# Altium schematic sheet Current Sense.SchDoc
size C
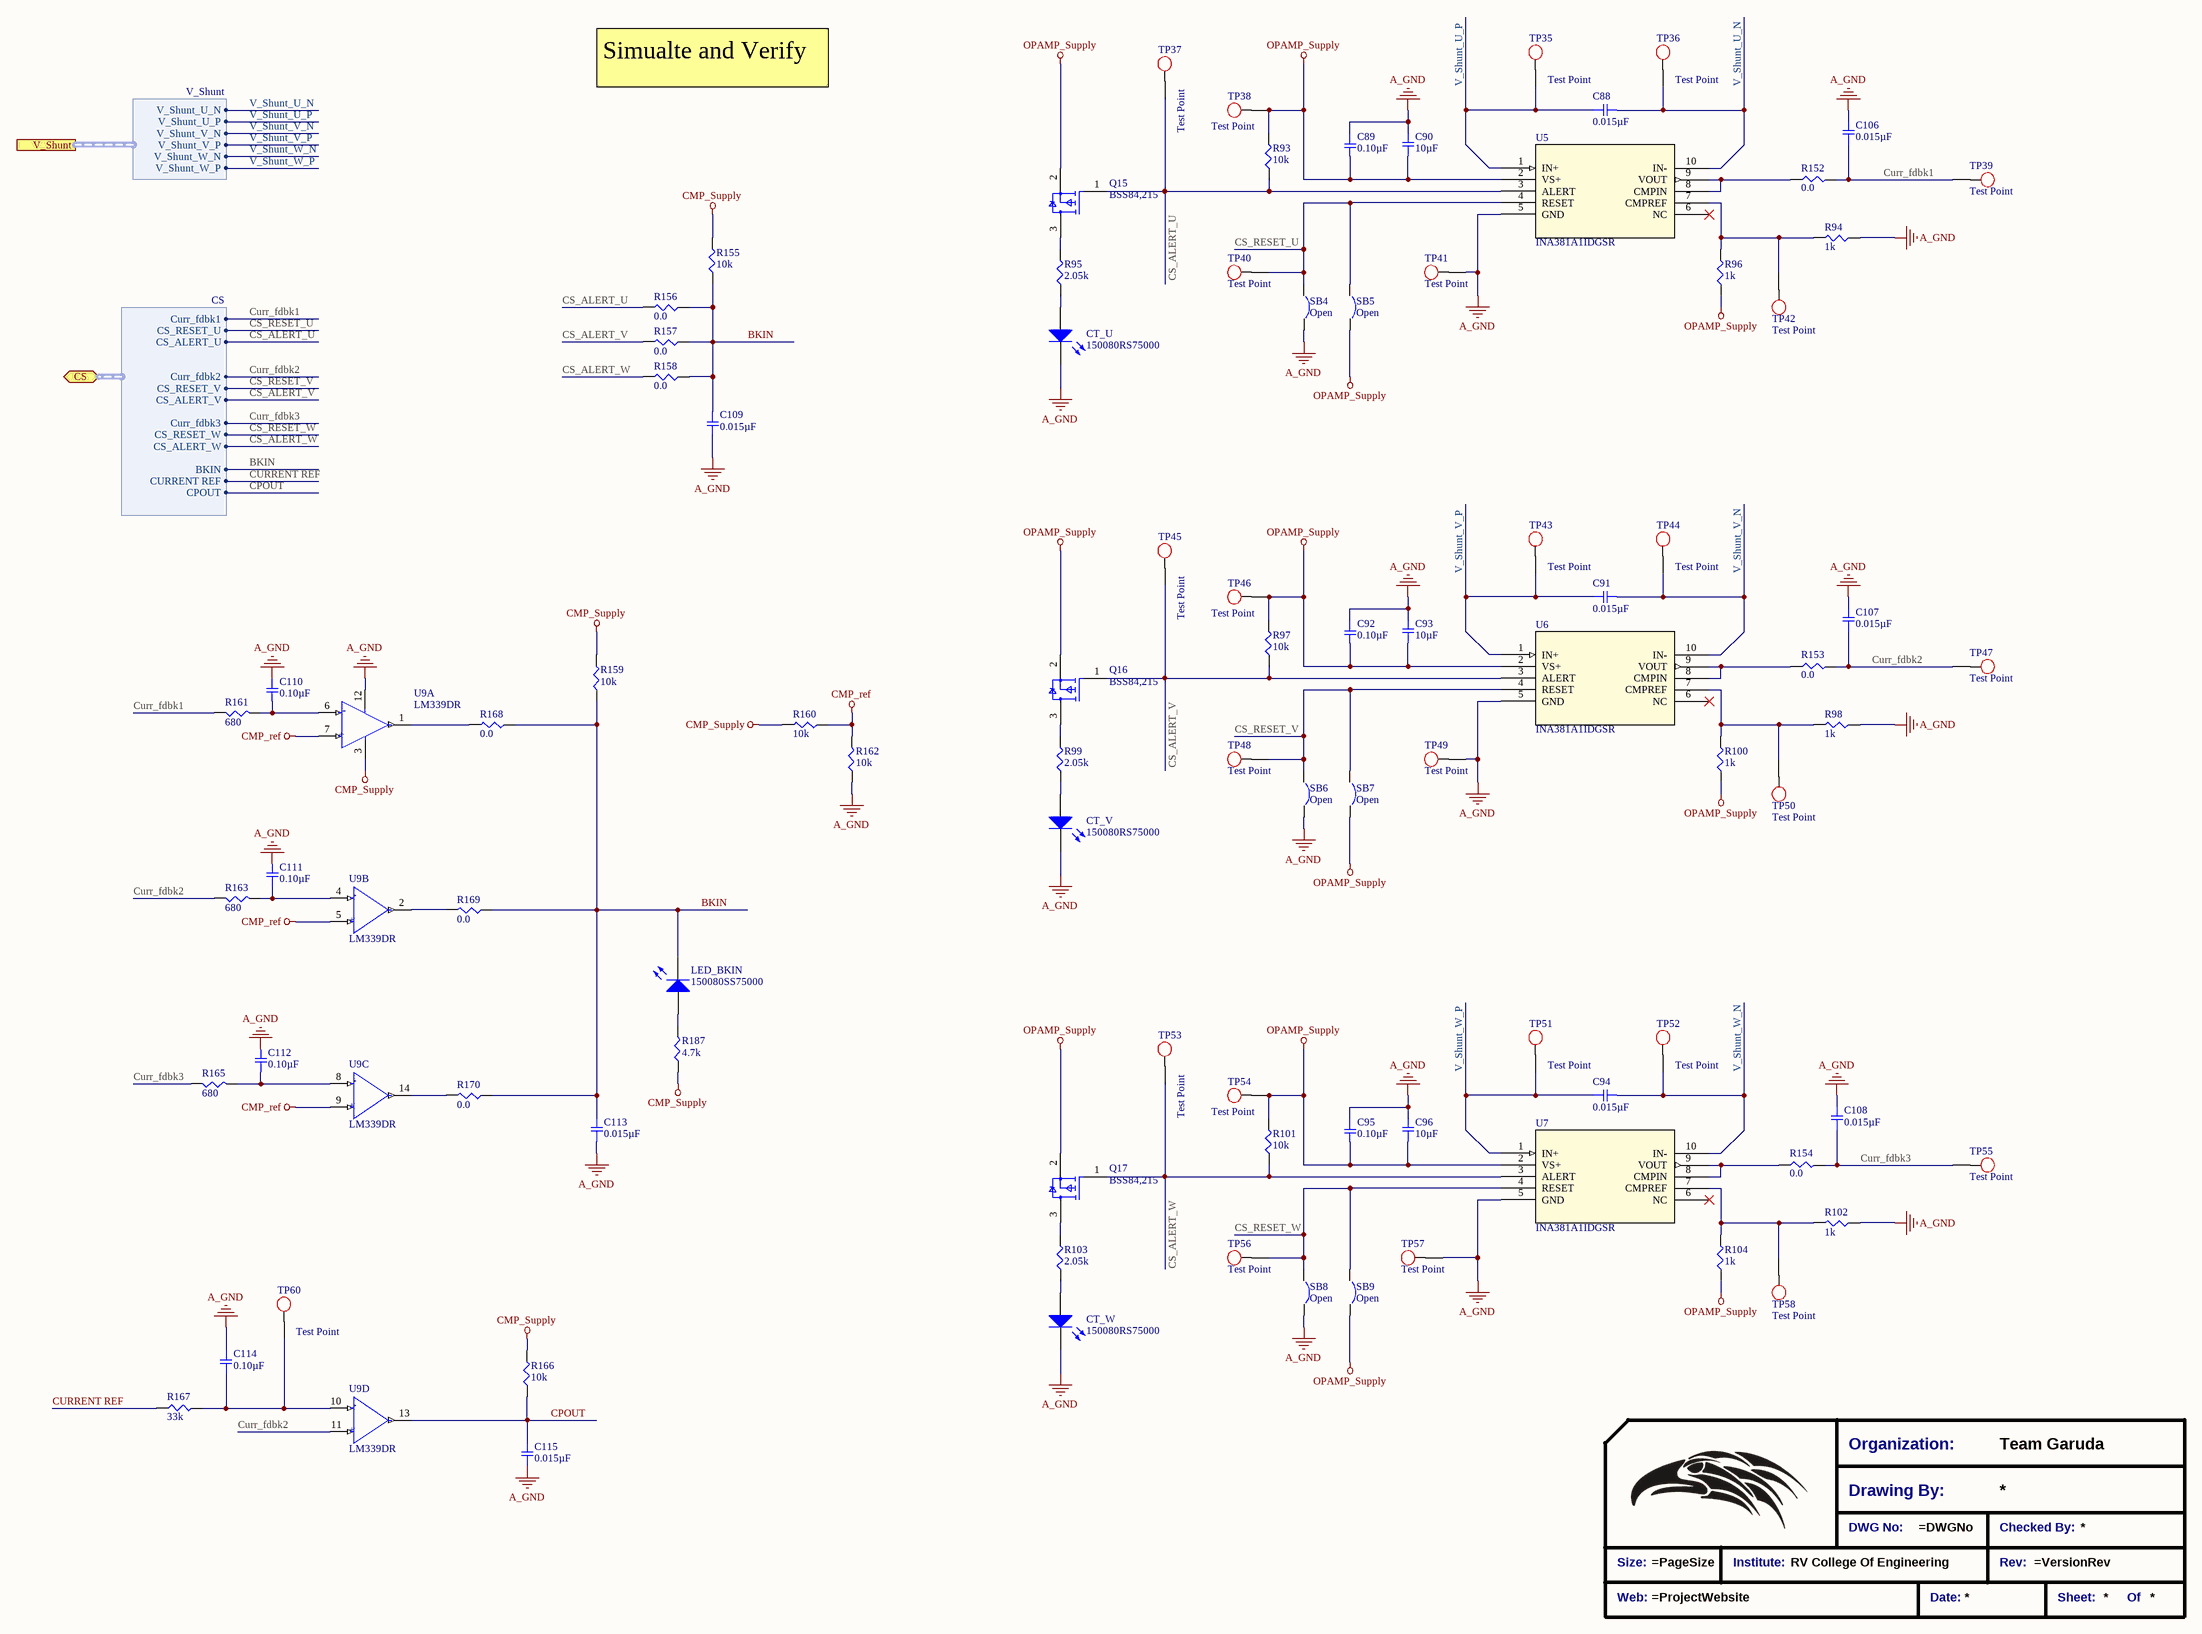
[diagram p0: Current Sense.SchDoc]

## Parts
*?  Title_Block  (value not drawn)  (graphical)
C88  0.015µF  [SMD-0603C]
C89  0.10µF  [SMD-0805C]
C90  10µF  [SMD-1206C]
C91  0.015µF  [SMD-0603C]
C92  0.10µF  [SMD-0805C]
C93  10µF  [SMD-1206C]
C94  0.015µF  [SMD-0603C]
C95  0.10µF  [SMD-0805C]
C96  10µF  [SMD-1206C]
C106  0.015µF  [SMD-0603C]
C107  0.015µF  [SMD-0603C]
C108  0.015µF  [SMD-0603C]
C109  0.015µF  [SMD-0603C]
C110  0.10µF  [SMD-0805C]
C111  0.10µF  [SMD-0805C]
C112  0.10µF  [SMD-0805C]
C113  0.015µF  [SMD-0603C]
C114  0.10µF  [SMD-0805C]
C115  0.015µF  [SMD-0603C]
CT_U  150080RS75000  [0805_A]
CT_V  150080RS75000  [0805_A]
CT_W  150080RS75000  [0805_A]
LED_BKIN  150080SS75000  [0805_A]
Q15  BSS84,215  [FP-SOT23-MFG]
Q16  BSS84,215  [FP-SOT23-MFG]
Q17  BSS84,215  [FP-SOT23-MFG]
R93  10k  [SMD-0603-RES]
R94  1k  [SMD-0603-RES]
R95  2.05k  [SMD-0603-RES]
R96  1k  [SMD-0603-RES]
R97  10k  [SMD-0603-RES]
R98  1k  [SMD-0603-RES]
R99  2.05k  [SMD-0603-RES]
R100  1k  [SMD-0603-RES]
R101  10k  [SMD-0603-RES]
R102  1k  [SMD-0603-RES]
R103  2.05k  [SMD-0603-RES]
R104  1k  [SMD-0603-RES]
R152  0.0  [SMD-0603-RES]
R153  0.0  [SMD-0603-RES]
R154  0.0  [SMD-0603-RES]
R155  10k  [SMD-0603-RES]
R156  0.0  [SMD-0603-RES]
R157  0.0  [SMD-0603-RES]
R158  0.0  [SMD-0603-RES]
R159  10k  [SMD-0603-RES]
R160  10k  [SMD-0603-RES]
R161  680  [SMD-0603-RES]
R162  10k  [SMD-0603-RES]
R163  680  [SMD-0603-RES]
R165  680  [SMD-0603-RES]
R166  10k  [SMD-0603-RES]
R167  33k  [SMD-0603-RES]
R168  0.0  [SMD-0603-RES]
R169  0.0  [SMD-0603-RES]
R170  0.0  [SMD-0603-RES]
R187  4.7k  [SMD-0805-RES]
SB4  Open  [SB_0603]  (no BOM)
SB5  Open  [SB_0603]  (no BOM)
SB6  Open  [SB_0603]  (no BOM)
SB7  Open  [SB_0603]  (no BOM)
SB8  Open  [SB_0603]  (no BOM)
SB9  Open  [SB_0603]  (no BOM)
TP35  Test Point  [Test_point_THT]  (no BOM)
TP36  Test Point  [Test_point_THT]  (no BOM)
TP37  Test Point  [Test_point_THT]  (no BOM)
TP38  Test Point  [Test_point_SMD]  (no BOM)
TP39  Test Point  [Test_point_THT]  (no BOM)
TP40  Test Point  [Test_point_SMD]  (no BOM)
TP41  Test Point  [Test_point_THT]  (no BOM)
TP42  Test Point  [Test_point_THT]  (no BOM)
TP43  Test Point  [Test_point_THT]  (no BOM)
TP44  Test Point  [Test_point_THT]  (no BOM)
TP45  Test Point  [Test_point_THT]  (no BOM)
TP46  Test Point  [Test_point_SMD]  (no BOM)
TP47  Test Point  [Test_point_THT]  (no BOM)
TP48  Test Point  [Test_point_SMD]  (no BOM)
TP49  Test Point  [Test_point_THT]  (no BOM)
TP50  Test Point  [Test_point_THT]  (no BOM)
TP51  Test Point  [Test_point_THT]  (no BOM)
TP52  Test Point  [Test_point_THT]  (no BOM)
TP53  Test Point  [Test_point_THT]  (no BOM)
TP54  Test Point  [Test_point_SMD]  (no BOM)
TP55  Test Point  [Test_point_THT]  (no BOM)
TP56  Test Point  [Test_point_SMD]  (no BOM)
TP57  Test Point  [Test_point_THT]  (no BOM)
TP58  Test Point  [Test_point_THT]  (no BOM)
TP60  Test Point  [Test_point_THT]  (no BOM)
U5  INA381A1IDGSR  [TSSOP50P490X110-10N]
U6  INA381A1IDGSR  [TSSOP50P490X110-10N]
U7  INA381A1IDGSR  [TSSOP50P490X110-10N]
U9  LM339DR  [FP-D0014A-MFG]  (parts A,B,C,D of 4)

## Ports
CS (bidir, harness CS), V_Shunt (harness V_Shunt)

## Harnesses
CS: Curr_fdbk1, CS_RESET_U, CS_ALERT_U, Curr_fdbk2, CS_RESET_V, CS_ALERT_V, Curr_fdbk3, CS_RESET_W, CS_ALERT_W, BKIN, CURRENT REF, CPOUT
V_Shunt: V_Shunt_U_N, V_Shunt_U_P, V_Shunt_V_N, V_Shunt_V_P, V_Shunt_W_N, V_Shunt_W_P

## Nets
A_GND: C89.1 C90.2 C92.1 C93.2 C95.1 C96.2 C106.2 C107.2 C108.2 C109.2 C110.1 C111.2 C112.2 C113.1 C114.2 C115.1 CT_U.1(K) CT_V.1(K) CT_W.1(K) R94.1 R98.1 R102.1 R162.1 SB4.1 SB6.1 SB8.1 TP41.1 TP49.1 TP57.1 U5.5(GND) U6.5(GND) U7.5(GND) U9.12(GND)
CMP_ref: R160.1 R162.2 U9.5(2IN+) U9.7(1IN+) U9.9(3IN+)
CMP_Supply: R155.2 R159.2 R160.2 R166.2 R187.1 U9.3(VCC)
OPAMP_Supply: C89.2 C90.1 C92.2 C93.1 C95.2 C96.1 Q15.2(S) Q16.2(S) Q17.2(S) R93.2 R96.1 R97.2 R100.1 R101.2 R104.1 SB5.1 SB7.1 SB9.1 TP38.1 TP46.1 TP54.1 U5.2(VS+) U6.2(VS+) U7.2(VS+)
BKIN: C109.1 C113.2 LED_BKIN.1(K) R155.1 R156.1 R157.1 R158.1 R159.1 R168.1 R169.1 R170.1 ; port CS.BKIN
CPOUT: C115.2 R166.1 U9.13(OUT4) ; port CS.CPOUT
CS_ALERT_U: Q15.1(G) R93.1 R156.2 TP37.1 U5.3(ALERT) ; port CS.CS_ALERT_U
CS_ALERT_V: Q16.1(G) R97.1 R157.2 TP45.1 U6.3(ALERT) ; port CS.CS_ALERT_V
CS_ALERT_W: Q17.1(G) R101.1 R158.2 TP53.1 U7.3(ALERT) ; port CS.CS_ALERT_W
CS_RESET_U: SB4.2 SB5.2 TP40.1 U5.4(RESET) ; port CS.CS_RESET_U
CS_RESET_V: SB6.2 SB7.2 TP48.1 U6.4(RESET) ; port CS.CS_RESET_V
CS_RESET_W: SB8.2 SB9.2 TP56.1 U7.4(RESET) ; port CS.CS_RESET_W
Curr_fdbk1: C106.1 R152.2 R161.1 TP39.1 ; port CS.Curr_fdbk1
Curr_fdbk2: C107.1 R153.2 R163.1 TP47.1 U9.11(4IN+) ; port CS.Curr_fdbk2
Curr_fdbk3: C108.1 R154.2 R165.1 TP55.1 ; port CS.Curr_fdbk3
CURRENT REF: R167.1 ; port CS.CURRENT REF
V_Shunt_U_N: C88.2 TP36.1 U5.10(IN-) ; port V_Shunt.V_Shunt_U_N
V_Shunt_U_P: C88.1 TP35.1 U5.1(IN+) ; port V_Shunt.V_Shunt_U_P
V_Shunt_V_N: C91.2 TP44.1 U6.10(IN-) ; port V_Shunt.V_Shunt_V_N
V_Shunt_V_P: C91.1 TP43.1 U6.1(IN+) ; port V_Shunt.V_Shunt_V_P
V_Shunt_W_N: C94.2 TP52.1 U7.10(IN-) ; port V_Shunt.V_Shunt_W_N
V_Shunt_W_P: C94.1 TP51.1 U7.1(IN+) ; port V_Shunt.V_Shunt_W_P
NetC110_2: C110.2 R161.2 U9.6(1IN-)
NetC111_1: C111.1 R163.2 U9.4(2IN-)
NetC112_1: C112.1 R165.2 U9.8(3IN-)
NetC114_1: C114.1 R167.2 TP60.1 U9.10(4IN-)
NetCT_U_2: CT_U.2(A) R95.1
NetCT_V_2: CT_V.2(A) R99.1
NetCT_W_2: CT_W.2(A) R103.1
NetLED_BKIN_2: LED_BKIN.2(A) R187.2
NetQ15_3: Q15.3(D) R95.2
NetQ16_3: Q16.3(D) R99.2
NetQ17_3: Q17.3(D) R103.2
NetR94_2: R94.2 R96.2 TP42.1 U5.7(CMPREF)
NetR98_2: R98.2 R100.2 TP50.1 U6.7(CMPREF)
NetR102_2: R102.2 R104.2 TP58.1 U7.7(CMPREF)
NetR152_1: R152.1 U5.8(CMPIN) U5.9(VOUT)
NetR153_1: R153.1 U6.8(CMPIN) U6.9(VOUT)
NetR154_1: R154.1 U7.8(CMPIN) U7.9(VOUT)
NetR168_2: R168.2 U9.1(1OUT)
NetR169_2: R169.2 U9.2(2OUT)
NetR170_2: R170.2 U9.14(OUT3)

Not connected (* = marked no-connect by the designer): U5 6(NC)*; U6 6(NC)*; U7 6(NC)*

## Notes on the sheet
- Simualte and Verify
- (in symbol CMP-04896-000028-1, part A) -; +
- (in symbol CMP-04896-000028-1, part B) -; +
- (in symbol CMP-04896-000028-1, part C) -; +
- (in symbol CMP-04896-000028-1, part D) -; +
- (in symbol Title_Block) Organization:; Team Garuda; Drawing By:; DWG No:; Checked By:; Size:; Institute:; RV College Of Engineering; Rev:; Web:; Date:; Sheet:; Of

## Library data of the parts
*? = Title_Block: Standard Title Block
C88 C91 C94 C106-C109 C113 C115 = GCJ188R72A153KA01D: CAP CER 0.015UF 100V X7R 0603; Manufacturer: Murata Electronics North America; Factory Stock: 0; Unit Price (USD): 0.26; Minimum Quantity: 1; Tolerance: ±10%; Datasheets: http://www.murata.com/~/media/webrenewal/support/library/catalog/products/capacitor/mlcc/c03e.ashx; Image: //media.digikey.com/Renders/Murata%20Renders/0603%28LQG18%29.jpg; Digi-Key Part Number: 490-5770-1-ND; Part Number: GCJ188R72A153KA01D; Quantity Available: 450; @ qty: 0; Packaging: Cut Tape (CT); Series: GCJ; Part Status: Active; Value: 0.015µF; Voltage: 100V; Temperature Coefficient: X7R; Operating Temperature: -55°C ~ 125°C; Features: Soft Termination; Ratings: AEC-Q200; Applications: Automotive, Boardflex Sensitive; Mounting Type: Surface Mount, MLCC; Package / Case: 0603 (1608 Metric); Size / Dimension: 0.063" L x 0.031" W (1.60mm x 0.80mm); Height - Seated (Max): -; Thickness (Max): 0.031" (0.80mm); Lead Spacing: -; Lead Style: -
C89 C92 C95 C110-C112 C114 = GCM21BR71H104KA37K: CAP CER 0.1UF 50V X7R 0805; Manufacturer: Murata Electronics North America; Factory Stock: 0; Unit Price (USD): 0.12; Minimum Quantity: 1; Tolerance: ±10%; Datasheets: http://www.murata.com/~/media/webrenewal/support/library/catalog/products/capacitor/mlcc/c03e.ashx; Image: //media.digikey.com/photos/Murata%20Photos/NCP,GCM%20SERIES%200805.jpg; Digi-Key Part Number: 490-8049-1-ND; Part Number: GCM21BR71H104KA37K; Quantity Available: 322; @ qty: 0; Packaging: Cut Tape (CT); Series: GCM; Part Status: Active; Value: 0.10µF; Voltage: 50V; Temperature Coefficient: X7R; Operating Temperature: -55°C ~ 125°C; Features: -; Ratings: AEC-Q200; Applications: Automotive; Mounting Type: Surface Mount, MLCC; Package / Case: 0805 (2012 Metric); Size / Dimension: 0.079" L x 0.049" W (2.00mm x 1.25mm); Height - Seated (Max): -; Thickness (Max): 0.055" (1.40mm); Lead Spacing: -; Lead Style: -
C90 C93 C96 = GRJ31CR71E106KE11L: CAP CER 10UF 25V X7R 1206; Manufacturer: Murata Electronics North America; Factory Stock: 0; Unit Price (USD): 0.69; Minimum Quantity: 1; Tolerance: ±10%; Datasheets: http://www.murata.com/~/media/webrenewal/support/library/catalog/products/capacitor/mlcc/c02e.pdf; Image: //media.digikey.com/Renders/Murata%20Renders/GR331BD72E473KW01L.jpg; Digi-Key Part Number: 490-10940-1-ND; Part Number: GRJ31CR71E106KE11L; Quantity Available: 1598; @ qty: 0; Packaging: Cut Tape (CT); Series: GRJ; Part Status: Active; Value: 10µF; Voltage: 25V; Temperature Coefficient: X7R; Operating Temperature: -55°C ~ 125°C; Features: Soft Termination; Ratings: -; Applications: Boardflex Sensitive; Mounting Type: Surface Mount, MLCC; Package / Case: 1206 (3216 Metric); Size / Dimension: 0.126" L x 0.063" W (3.20mm x 1.60mm); Height - Seated (Max): -; Thickness (Max): 0.075" (1.90mm); Lead Spacing: -; Lead Style: -
CT_U CT_V CT_W = 150080RS75000: SMD mono-color Chip LED, WL-SMCW, Red; PackageReference: 0805_A; Color: Red; PartNumber: 150080RS75000; ComponentLink1Description: Manufacturer URL; ComponentLink1URL: http://www.we-online.com; ComponentLink2Description: Datasheet; ComponentLink2URL: http://katalog.we-online.com/led/datasheet/150080RS75000.pdf
LED_BKIN = 150080SS75000: SMD mono-color Chip LED, WL-SMCW, Super Red; PackageReference: 0805_A; Color: Super Red; PartNumber: 150080SS75000; ComponentLink1Description: Manufacturer URL; ComponentLink1URL: http://www.we-online.com; ComponentLink2Description: Datasheet; ComponentLink2URL: http://katalog.we-online.com/led/datasheet/150080SS75000.pdf
Q15-Q17 = CMP-14409-000006-1: MOSFET P-CH 50V 130MA SOT-23; Manufacturer: Nexperia USA Inc.; Drain To Source Breakdown Voltage: -50V; Max Junction Temp: +150°C; Threshold Vgs Min: -0.8V; Turn On Delay Time: 3ns; Power Dissipation: 250mW; Turn Off Delay Time: 7ns; Gate To Source Voltage: 20V; Number Of Channels: 1; Input Capacitace At Vds: 25pF @ -25V; Threshold Vgs Max: -2V; Continuous Drain Current: -130mA; Depletion Mode: False; Drain To Source Resistance: 6Ω; Rthja Max: 500K/W; Octopart: https://octopart.com/bss84%2C215-nexperia-78739375; Ipc Land Pattern Name: SOT95P230X100-3; Drain To Source Voltage: -50V; Lead Free: Yes; Temperature Range High: +150°C; Automotive: No; Device Class L2: Transistors; Manufacturer Part Number: BSS84,215; Package: SOT23; ComponentLink2URL: https://assets.nexperia.com/documents/data-sheet/BSS84.pdf; Category: Trans; RoHS: TRUE; Temperature Range Low: -65°C; ComponentLink2Description: Datasheet; Device Class L1: Discrete Semiconductors; Number Of P Channels: 1; Device Class L3: MOSFETs; Height: 1.1mm; Digikey Description: MOSFET P-CH 50V 130MA SOT-23; Temperature: -65°C to +150°C; Footprint Url: https://assets.nexperia.com/documents/outline-drawing/SOT23.pdf
R93 R97 R101 R155 R159 R160 R162 R166 = ERJ-3EKF1002V: RES SMD 10K OHM 1% 1/10W 0603; Manufacturer: Panasonic Electronic Components; Factory Stock: 0; Unit Price (USD): 0.00379; @ qty: 1500; Minimum Quantity: 1; Power (Watts): 0.1W, 1/10W; Temperature Coefficient: ±100ppm/°C; Part Number: ERJ-3EKF1002V; Datasheets: http://industrial.panasonic.com/www-cgi/jvcr13pz.cgi?E+PZ+3+AOA0002+ERJ3EKF1002V+7+WW; Image: //media.digikey.com/Photos/Panasonic%20Photos/MFG_ERJ-P6W%20Series.jpg; Digi-Key Part Number: P10.0KHCT-ND; Quantity Available: 6703141; Packaging: Cut Tape (CT); Series: ERJ; Part Status: Active; Value: 10k; Tolerance: ±1%; Composition: Thick Film; Features: Automotive AEC-Q200; Operating Temperature: -55°C ~ 155°C; Package / Case: 0603 (1608 Metric); Supplier Device Package: 0603; Size / Dimension: 0.063" L x 0.031" W (1.60mm x 0.80mm); Height - Seated (Max): 0.022" (0.55mm); Number of Terminations: 2; Failure Rate: -
R94 R96 R98 R100 R102 R104 = ERJ-3EKF1001V: RES SMD 1K OHM 1% 1/10W 0603; Manufacturer: Panasonic Electronic Components; Factory Stock: 0; Unit Price (USD): 0.00379; @ qty: 1500; Minimum Quantity: 1; Power (Watts): 0.1W, 1/10W; Temperature Coefficient: ±100ppm/°C; Part Number: ERJ-3EKF1001V; Datasheets: http://industrial.panasonic.com/www-cgi/jvcr13pz.cgi?E+PZ+3+AOA0002+ERJ3EKF1001V+7+WW; Image: //media.digikey.com/Photos/Panasonic%20Photos/MFG_ERJ-P6W%20Series.jpg; Digi-Key Part Number: P1.00KHCT-ND; Quantity Available: 5218845; Packaging: Cut Tape (CT); Series: ERJ; Part Status: Active; Value: 1k; Tolerance: ±1%; Composition: Thick Film; Features: Automotive AEC-Q200; Operating Temperature: -55°C ~ 155°C; Package / Case: 0603 (1608 Metric); Supplier Device Package: 0603; Size / Dimension: 0.063" L x 0.031" W (1.60mm x 0.80mm); Height - Seated (Max): 0.022" (0.55mm); Number of Terminations: 2; Failure Rate: -
R95 R99 R103 = ERJ-3EKF2051V: RES SMD 2.05K OHM 1% 1/10W 0603; Manufacturer: Panasonic Electronic Components; Factory Stock: 0; Unit Price (USD): 0.00379; @ qty: 1500; Minimum Quantity: 1; Power (Watts): 0.1W, 1/10W; Temperature Coefficient: ±100ppm/°C; Part Number: ERJ-3EKF2051V; Datasheets: http://industrial.panasonic.com/www-cgi/jvcr13pz.cgi?E+PZ+3+AOA0002+ERJ3EKF2051V+7+WW; Image: //media.digikey.com/Photos/Panasonic%20Photos/MFG_ERJ-P6W%20Series.jpg; Digi-Key Part Number: P2.05KHCT-ND; Quantity Available: 48175; Packaging: Cut Tape (CT); Series: ERJ; Part Status: Active; Value: 2.05k; Tolerance: ±1%; Composition: Thick Film; Features: Automotive AEC-Q200; Operating Temperature: -55°C ~ 155°C; Package / Case: 0603 (1608 Metric); Supplier Device Package: 0603; Size / Dimension: 0.063" L x 0.031" W (1.60mm x 0.80mm); Height - Seated (Max): 0.022" (0.55mm); Number of Terminations: 2; Failure Rate: -
R152-R154 R156-R158 R168-R170 = ERJ-3GEY0R00V: RES SMD 0.0OHM JUMPER 1/10W 0603; Manufacturer: Panasonic Electronic Components; Factory Stock: 0; Unit Price (USD): 0.00352; @ qty: 1500; Minimum Quantity: 1; Power (Watts): 0.1W, 1/10W; Part Number: ERJ-3GEY0R00V; Datasheets: http://industrial.panasonic.com/www-cgi/jvcr13pz.cgi?E+PZ+3+AOA0001+ERJ3GEY0R00V+7+WW; Image: //media.digikey.com/Photos/Panasonic%20Photos/MFG_ERJ-P6W%20Series.jpg; Digi-Key Part Number: P0.0GCT-ND; Quantity Available: 4813372; Packaging: Cut Tape (CT); Series: ERJ; Part Status: Active; Value: 0.0; Tolerance: Jumper; Composition: Thick Film; Features: Automotive AEC-Q200; Temperature Coefficient: -; Operating Temperature: -55°C ~ 155°C; Package / Case: 0603 (1608 Metric); Supplier Device Package: 0603; Size / Dimension: 0.063" L x 0.031" W (1.60mm x 0.80mm); Height - Seated (Max): 0.022" (0.55mm); Number of Terminations: 2; Failure Rate: -
R161 R163 R165 = ERJ-3EKF6800V: RES SMD 680 OHM 1% 1/10W 0603; Manufacturer: Panasonic Electronic Components; Factory Stock: 0; Unit Price (USD): 0.00379; @ qty: 1500; Minimum Quantity: 1; Power (Watts): 0.1W, 1/10W; Temperature Coefficient: ±100ppm/°C; Part Number: ERJ-3EKF6800V; Datasheets: http://industrial.panasonic.com/www-cgi/jvcr13pz.cgi?E+PZ+3+AOA0002+ERJ3EKF6800V+7+WW; Image: //media.digikey.com/Photos/Panasonic%20Photos/MFG_ERJ-P6W%20Series.jpg; Digi-Key Part Number: P680HCT-ND; Quantity Available: 89165; Packaging: Cut Tape (CT); Series: ERJ; Part Status: Active; Value: 680; Tolerance: ±1%; Composition: Thick Film; Features: Automotive AEC-Q200; Operating Temperature: -55°C ~ 155°C; Package / Case: 0603 (1608 Metric); Supplier Device Package: 0603; Size / Dimension: 0.063" L x 0.031" W (1.60mm x 0.80mm); Height - Seated (Max): 0.022" (0.55mm); Number of Terminations: 2; Failure Rate: -
R167 = ERJ-PA3F3302V: RES SMD 33K OHM 1% 1/4W 0603; Manufacturer: Panasonic Electronic Components; Factory Stock: 0; Unit Price (USD): 0.02372; @ qty: 1500; Minimum Quantity: 1; Power (Watts): 0.25W, 1/4W; Temperature Coefficient: ±100ppm/°C; Part Number: ERJ-PA3F3302V; Datasheets: https://industrial.panasonic.com/cdbs/www-data/pdf/RDA0000/AOA0000C243.pdf; Image: //media.digikey.com/Photos/Panasonic%20Photos/MFG_ERJ-P6W%20Series.jpg; Digi-Key Part Number: P33KBYCT-ND; Quantity Available: 3504; Packaging: Cut Tape (CT); Series: ERJ; Part Status: Active; Value: 33k; Tolerance: ±1%; Composition: Thick Film; Features: Automotive AEC-Q200, Pulse Withstanding; Operating Temperature: -55°C ~ 155°C; Package / Case: 0603 (1608 Metric); Supplier Device Package: 0603; Size / Dimension: 0.063" L x 0.031" W (1.60mm x 0.80mm); Height - Seated (Max): 0.022" (0.55mm); Number of Terminations: 2; Failure Rate: -
R187 = ERJ-6ENF4701V: RES SMD 4.7K OHM 1% 1/8W 0805; Manufacturer: Panasonic Electronic Components; Factory Stock: 0; Unit Price (USD): 0.00729; @ qty: 1500; Minimum Quantity: 1; Power (Watts): 0.125W, 1/8W; Temperature Coefficient: ±100ppm/°C; Part Number: ERJ-6ENF4701V; Datasheets: http://industrial.panasonic.com/www-cgi/jvcr13pz.cgi?E+PZ+3+AOA0002+ERJ6ENF4701V+7+WW; Image: //media.digikey.com/Renders/Panasonic%20Renders/ERJ-0805%20Pkg.jpg; Digi-Key Part Number: P4.70KCCT-ND; Quantity Available: 312387; Packaging: Cut Tape (CT); Series: ERJ; Part Status: Active; Value: 4.7k; Tolerance: ±1%; Composition: Thick Film; Features: Automotive AEC-Q200; Operating Temperature: -55°C ~ 155°C; Package / Case: 0805 (2012 Metric); Supplier Device Package: 0805; Size / Dimension: 0.079" L x 0.049" W (2.00mm x 1.25mm); Height - Seated (Max): 0.028" (0.70mm); Number of Terminations: 2; Failure Rate: -
SB4-SB9 = Solder Bridge: Circuit Breaker; Published: 24-Mar-1999; Revision: July-2002: Re-released for DXP Platform.; Publisher: Altium Limited
U5-U7 = INA381A1IDGSR: No Description Available; SourceLibrary: Texas_Instruments_2020-07-20; Built_By: EMA_Matt; Vendor: Texas Instruments; Datasheet: https://www.ti.com/lit/ds/symlink/ina381.pdf?ts=1595282869145&ref_url=https%253A%252F%252Fwww.ti.com%252Fstore%252Fti%252Fen%252Fp%252Fproduct%252F%253Fp%253DINA381A1IDGSR; Copyright: Copyright (C) 2018 Accelerated Designs. All rights reserved; Manufacturer_Part_Number: INA381A1IDGSR; RefDes: RefDes; Type: DEV
U9 = CMP-04896-000028-1: IC QUAD DIFF COMP 14-SOIC; Manufacturer: Texas Instruments; Nominal Supply Current: 0.8mA; Min Dual Supply Voltage: 1V; Number Of Channels: 4; Input Offset Voltage: 2mV; Max Junction Temp: +70°C; Min Supply Voltage: 2V; Response Time: 1.3us; Max Dual Supply Voltage: 18V; Max Supply Voltage: 30V; Standoff Height: 0.1mm; Input Bias Current: -0.025uA; Output Current Per Channel: 6mA; Category: IC; Octopart: https://octopart.com/lm339dr-texas+instruments-45532; Automotive: No; Temperature: 0°C to +70°C; Ipc Land Pattern Name: SOIC127P600X175-14; Temperature Range Low: 0°C; Mouser Description: Analog Comparators Quad Differential; Lead Free: Yes; Digikey Description: IC QUAD DIFF COMP 14-SOIC; ComponentLink2URL: http://www.ti.com/lit/ds/symlink/lm339.pdf; Device Class L3: Comparators; Manufacturer Part Number: LM339DR; Temperature Range High: +70°C; Device Class L2: Linear ICs; Height: 1.75mm; Device Class L1: Integrated Circuits (ICs); Package: D0014A; RoHS: TRUE; ComponentLink2Description: Datasheet